# EAGLE design isoSPI UART Test Board rev1 (EAGLE 9.6.2)

## Sheet 1 of 2: PWR, ICs, I/O
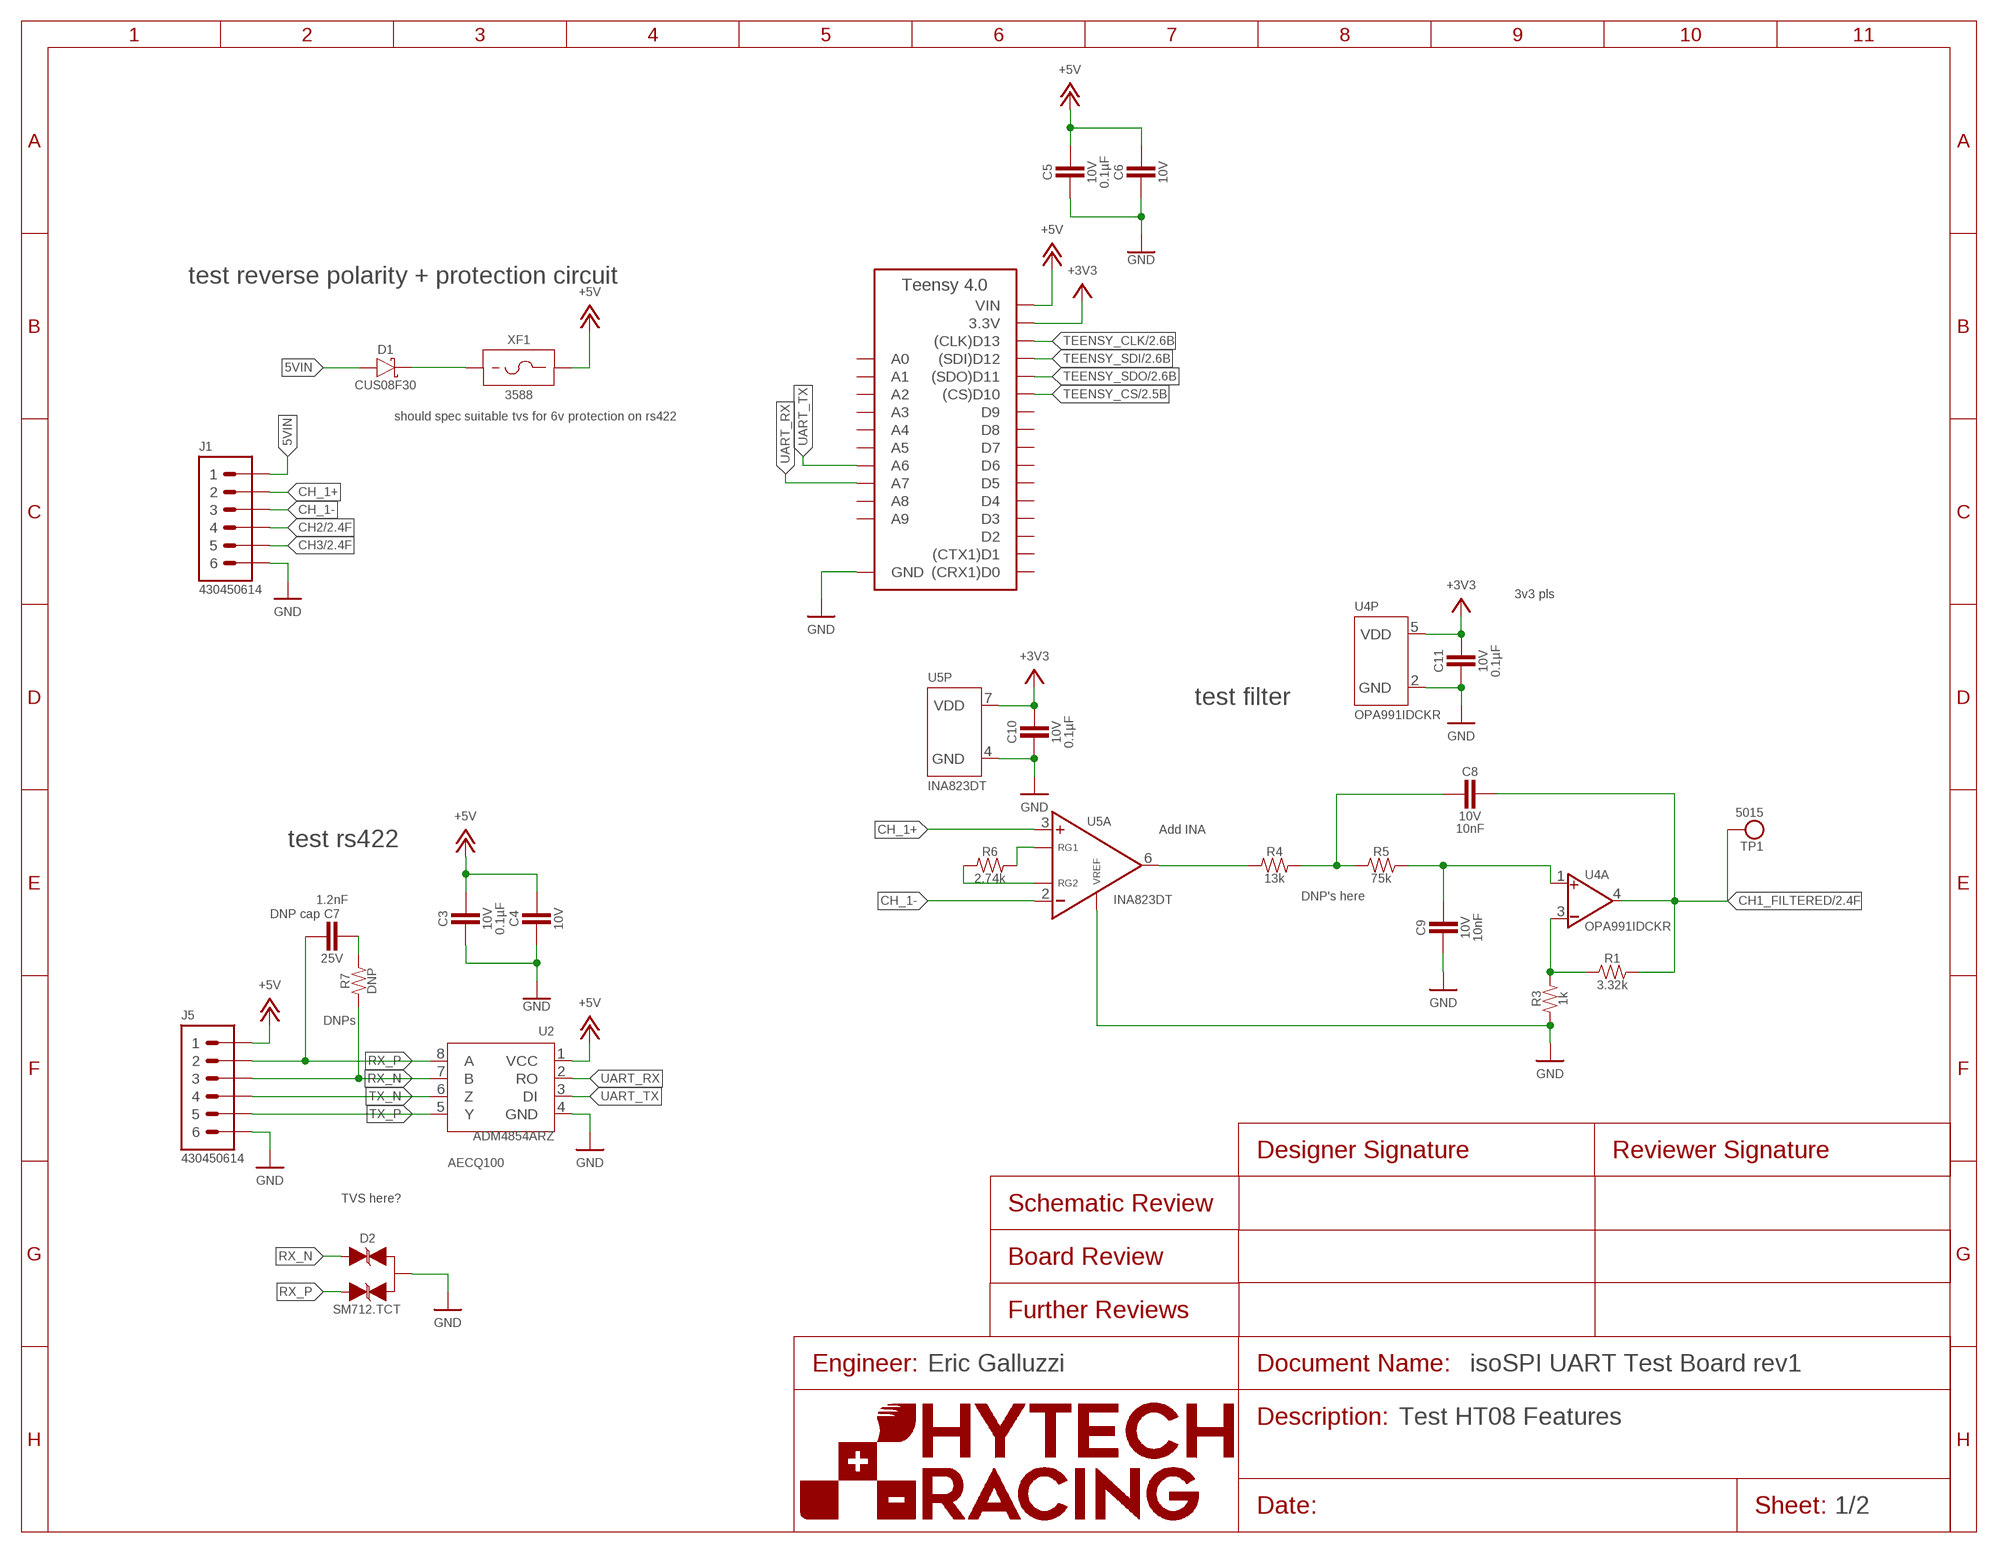
[diagram p0: schematic, sheet 1]
FRAME1 (FRAME): DESCRIPTION_1: Test HT08 Features; ENGINEER: Eric Galluzzi

### Parts
A1  TEENSY_4.0TH  [TEENSY_SHORT]
C3  CAPACITOR_0603_10V_0.1UF  [0603-CAP]
C4  CAPACITOR_0603_10V_1UF  [0603-CAP]
C5  CAPACITOR_0603_10V_0.1UF  [0603-CAP]
C6  CAPACITOR_0603_10V_1UF  [0603-CAP]
C7  CAPACITOR_0603_25V_1.2NF  [0603-CAP]
C8  CAPACITOR_0603_10V_10NF  [0603-CAP]
C9  CAPACITOR_0603_10V_10NF  [0603-CAP]
C10  CAPACITOR_0603_10V_0.1UF  [0603-CAP]
C11  CAPACITOR_0603_10V_0.1UF  [0603-CAP]
D1  SCHOTTKY_SOD323_30V  [SOD-323]
D2  TVS_BIDIRECTIONAL_DUALRS422  [SOT-23]
J1  CONNECTOR-6_μF_T_V_BLACK  [MOLEX_MICROFIT_PTH_VERTICAL_06_DUAL]
J5  CONNECTOR-6_μF_T_V_BLACK  [MOLEX_MICROFIT_PTH_VERTICAL_06_DUAL]
R1  RESISTOR_0603_3.32K  [0603-RES]
R3  RESISTOR_0603_1K  [0603-RES]
R4  RESISTOR_0603_13K  [0603-RES]
R5  RESISTOR_0603_75K  [0603-RES]
R6  RESISTOR_0603_2.74K  [0603-RES]
R7  RESISTOR_0603_DNP  [0603-RES]
TP1  TEST_POINT  [5015]
U2  ADM4854ARZ  [SOIC-08(NARROW,0.15")]
U4  OPAMP_1_CHANNEL_OPA991  [SC-70-5]
U5  INA823DT  [SOIC-08(NARROW,0.15")]
XF1  FUSE_HOLDER_MINIBLADESMD  [3588]

### Nets
5VIN: D1.A J1.1
+3V3: A1.3.3V C10.1 C11.1 U4.5(P:VDD) U5.7(P:VDD) ; also sheet 2
+5V: A1.VIN C3.1 C4.1 C5.1 C6.1 J5.1 U2.1(VCC) XF1.3 XF1.4
CH1: R4.1 U5.6(A:VOUT)
CH1_FILTERED: C8.1 R1.2 TP1.1 U4.4(A:VOUT) ; also sheet 2
CH2: J1.4 ; also sheet 2
CH3: J1.5 ; also sheet 2
CH_1+: J1.2 U5.3(A:VIN+)
CH_1-: J1.3 U5.2(A:VIN-)
GND: A1.AGND/GND(GND) A1.GND C3.2 C4.2 C5.2 C6.2 C9.2 C10.2 C11.2 D2.3(A) J1.6 J5.6 R3.1 U2.4(GND) U4.2(P:GND) U5.4(P:GND) U5.5(A:VREF) ; also sheet 2
N$2: C7.1 R7.2
N$3: D1.C XF1.1 XF1.2
N$5: R1.1 R3.2 U4.3(A:VIN-)
N$8: R6.2 U5.1(A:RG1)
N$9: R6.1 U5.8(A:RG2)
N$13: C8.2 R4.2 R5.1
N$14: C9.1 R5.2 U4.1(A:VIN+)
RX_N [diff pairs]: D2.1(C1) J5.3 R7.1 U2.7(B)
RX_P [diff pairs]: C7.2 D2.2(C2) J5.2 U2.8(A)
TEENSY_CLK: A1.D13((CLK)D13) ; also sheet 2
TEENSY_CS: A1.D10((CS)D10) ; also sheet 2
TEENSY_SDI: A1.D12((SDI)D12) ; also sheet 2
TEENSY_SDO: A1.D11((SDO)D11) ; also sheet 2
TX_N [diff pairs]: J5.4 U2.6(Z)
TX_P [diff pairs]: J5.5 U2.5(Y)
UART_RX: A1.D21(A7) U2.2(RO)
UART_TX: A1.D20(A6) U2.3(DI)
Unconnected: A1.D0((CRX1)D0) A1.D1((CTX1)D1) A1.D2 A1.D3 A1.D4 A1.D5 A1.D6 A1.D7 A1.D8 A1.D9 A1.D14(A0) A1.D15(A1) A1.D16(A2) A1.D17(A3) A1.D18(A4) A1.D19(A5) A1.D22(A8) A1.D23(A9)

### Notes on the sheet
- test reverse polarity + protection circuit
- should spec suitable tvs for 6v protection on rs422
- 3v3 pls
- test filter
- test rs422 | Add INA
- DNP's here
- DNP cap
- DNPs
- AECQ100
- TVS here?

## Sheet 2 of 2: isoSPI
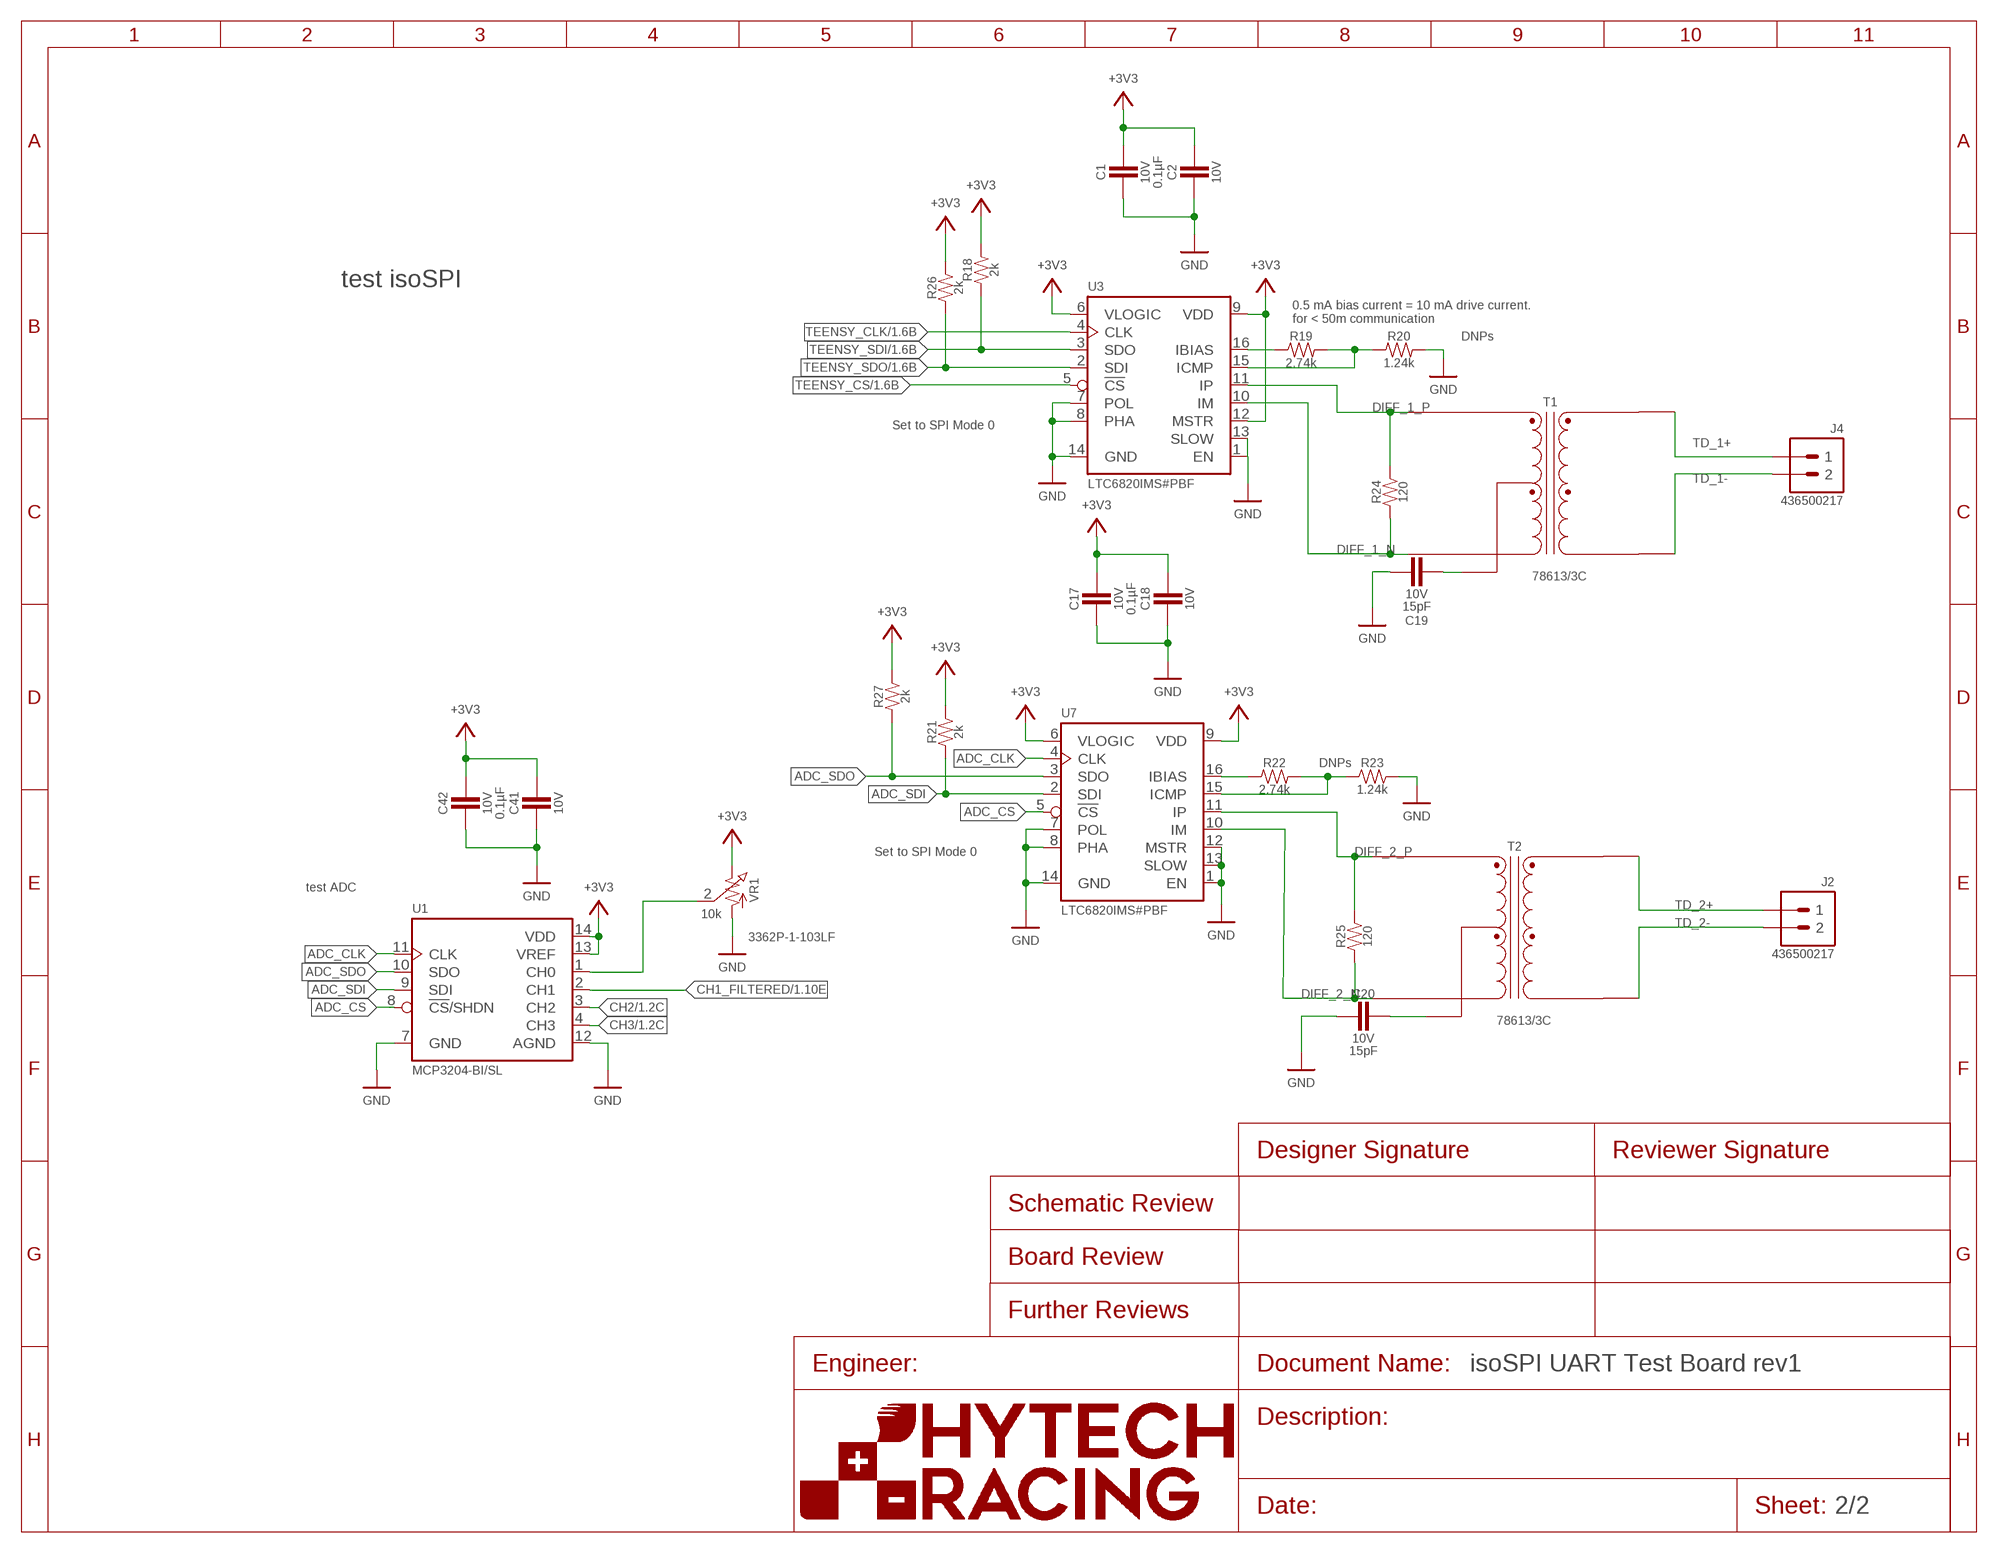
[diagram p1: schematic, sheet 2]

### Parts
C1  CAPACITOR_0603_10V_0.1UF  [0603-CAP]
C2  CAPACITOR_0603_10V_1UF  [0603-CAP]
C17  CAPACITOR_0603_10V_0.1UF  [0603-CAP]
C18  CAPACITOR_0603_10V_1UF  [0603-CAP]
C19  CAPACITOR_0603_10V_15PF  [0603-CAP]
C20  CAPACITOR_0603_10V_15PF  [0603-CAP]
C41  CAPACITOR_0603_10V_1UF  [0603-CAP]
C42  CAPACITOR_0603_10V_0.1UF  [0603-CAP]
J2  CONNECTOR-2_MF_T_V_  [MOLEX_MICROFIT_PTH_VERTICAL_02_SINGLE]
J4  CONNECTOR-2_MF_T_V_  [MOLEX_MICROFIT_PTH_VERTICAL_02_SINGLE]
R18  RESISTOR_0603_2K  [0603-RES]
R19  RESISTOR_0603_2.74K  [0603-RES]
R20  RESISTOR_0603_1.24K  [0603-RES]
R21  RESISTOR_0603_2K  [0603-RES]
R22  RESISTOR_0603_2.74K  [0603-RES]
R23  RESISTOR_0603_1.24K  [0603-RES]
R24  RESISTOR_0603_120  [0603-RES]
R25  RESISTOR_0603_120  [0603-RES]
R26  RESISTOR_0603_2K  [0603-RES]
R27  RESISTOR_0603_2K  [0603-RES]
T1  78613/3C  [78613/3C]
T2  78613/3C  [78613/3C]
U1  MCP3204  [SOIC-14]
U3  LTC6820  [MSOP-16]
U7  LTC6820  [MSOP-16]
VR1  RESISTOR_TRIMPOT_10K_3362P  [3362P]

### Nets
+3V3: C1.1 C2.1 C17.1 C18.1 C41.1 C42.1 R18.2 R21.2 R26.2 R27.2 U1.13(VREF) U1.14(VDD) U3.6(VLOGIC) U3.9(VDD) U3.12(MSTR) U7.6(VLOGIC) U7.9(VDD) VR1.3 ; also sheet 1
ADC_CLK: U1.11(CLK) U7.4(CLK)
ADC_CS: U1.8(!CS!/SHDN) U7.5(!CS)
ADC_SDI: R21.1 U1.9(SDI) U7.2(SDI)
ADC_SDO: R27.1 U1.10(SDO) U7.3(SDO)
CH1_FILTERED: U1.2(CH1) ; also sheet 1
CH2: U1.3(CH2) ; also sheet 1
CH3: U1.4(CH3) ; also sheet 1
DIFF_1_N [diff pairs]: R24.1 T1.3(PRI_2) U3.10(IM)
DIFF_1_P [diff pairs]: R24.2 T1.1(PRI_1) U3.11(IP)
DIFF_2_N [diff pairs]: R25.1 T2.3(PRI_2) U7.10(IM)
DIFF_2_P [diff pairs]: R25.2 T2.1(PRI_1) U7.11(IP)
GND: C1.2 C2.2 C17.2 C18.2 C19.2 C20.2 C41.2 C42.2 R20.2 R23.2 U1.7(GND) U1.12(AGND) U3.1(EN) U3.7(POL) U3.8(PHA) U3.13(SLOW) U3.14(GND) U7.1(EN) U7.7(POL) U7.8(PHA) U7.12(MSTR) U7.13(SLOW) U7.14(GND) VR1.1 ; also sheet 1
N$1: U1.1(CH0) VR1.2
N$4: R19.1 U3.16(IBIAS)
N$6: R19.2 R20.1 U3.15(ICMP)
N$16: R22.1 U7.16(IBIAS)
N$17: R22.2 R23.1 U7.15(ICMP)
N$18: C19.1 T1.2(PRI_CENTER_TAP)
N$19: C20.1 T2.2(PRI_CENTER_TAP)
TD_1+: J4.1 T1.6(SEC_2)
TD_1-: J4.2 T1.4(SEC_1)
TD_2+: J2.1 T2.6(SEC_2)
TD_2-: J2.2 T2.4(SEC_1)
TEENSY_CLK: U3.4(CLK) ; also sheet 1
TEENSY_CS: U3.5(!CS) ; also sheet 1
TEENSY_SDI: R18.1 U3.3(SDO) ; also sheet 1
TEENSY_SDO: R26.1 U3.2(SDI) ; also sheet 1

### Notes on the sheet
- test isoSPI
- 0.5 mA bias current = 10 mA drive current.
  for < 50m communication
- DNPs
- Set to SPI Mode 0
- DNPs
- Set to SPI Mode 0
- test ADC

## Library data of the parts
A1 = HyTechDevices:TEENSY_4.0: Teensy 4.0 Datasheet Requires ordering of: 2: 14 pin, 0.1" pitch female headers. Recommend Samtec SSM-114-L-SV for surface mount variant.; TEENSY: 4.0
C1 C3 C5 C10 C11 C17 C42 = HyTechDevices:CAPACITOR_?_*: Capacitor, Non-Polarized VJ...1BC Series Datasheet Samsung Datasheet Walsin Datasheet GRM188R61A226ME15D GRM188R61E106MA73D 885012006013 2220Y6300105KXTWS2 Yageo Class 2, X5R TDK C Series AVX Automotive MLCC KEMET X7R Series Kyocera AVX GRM21BR61H C1812W104KDRACTU; CAPACITANCE: 0.1µF; DKPN: 720-1688-1-ND; MANUFACTURER: Vishay Vitramon; MOPN: 77-VJ0603Y104JXQPBC; MPN: VJ0603Y104JXQPW1BC; TOLERANCE: 5%; VOLTAGE: 10V
C2 C4 C6 C18 C41 = HyTechDevices:CAPACITOR_?_*: Capacitor, Non-Polarized VJ...1BC Series Datasheet Samsung Datasheet Walsin Datasheet GRM188R61A226ME15D GRM188R61E106MA73D 885012006013 2220Y6300105KXTWS2 Yageo Class 2, X5R TDK C Series AVX Automotive MLCC KEMET X7R Series Kyocera AVX GRM21BR61H C1812W104KDRACTU; CAPACITANCE: 1µF; DKPN: 311-1796-1-ND; MANUFACTURER: Yageo; MOPN: 603-CC603KRX7R6BB105; MPN: CC0603KRX7R6BB105; TOLERANCE: 10%; VOLTAGE: 10V
C7 = HyTechDevices:CAPACITOR_?_*: Capacitor, Non-Polarized VJ...1BC Series Datasheet Samsung Datasheet Walsin Datasheet GRM188R61A226ME15D GRM188R61E106MA73D 885012006013 2220Y6300105KXTWS2 Yageo Class 2, X5R TDK C Series AVX Automotive MLCC KEMET X7R Series Kyocera AVX GRM21BR61H C1812W104KDRACTU; CAPACITANCE: 1.2nF; DKPN: 311-4079-2-ND; MANUFACTURER: YAGEO; MOPN: 603-CC603KRX7R8BB122; MPN: CC0603KRX7R8BB122; TOLERANCE: 10%; VOLTAGE: 25V
C8 C9 = HyTechDevices:CAPACITOR_?_*: Capacitor, Non-Polarized VJ...1BC Series Datasheet Samsung Datasheet Walsin Datasheet GRM188R61A226ME15D GRM188R61E106MA73D 885012006013 2220Y6300105KXTWS2 Yageo Class 2, X5R TDK C Series AVX Automotive MLCC KEMET X7R Series Kyocera AVX GRM21BR61H C1812W104KDRACTU; CAPACITANCE: 10nF; DKPN: 311-4054-1-ND; MANUFACTURER: Yageo; MOPN: 603-CC603KRX7R6BB103; MPN: CC0603KRX7R6BB103; TOLERANCE: 10%; VOLTAGE: 10V
C19 C20 = HyTechDevices:CAPACITOR_?_*: Capacitor, Non-Polarized VJ...1BC Series Datasheet Samsung Datasheet Walsin Datasheet GRM188R61A226ME15D GRM188R61E106MA73D 885012006013 2220Y6300105KXTWS2 Yageo Class 2, X5R TDK C Series AVX Automotive MLCC KEMET X7R Series Kyocera AVX GRM21BR61H C1812W104KDRACTU; CAPACITANCE: 15pF; DKPN: 720-VJ0603A150FXQPW1BCCT-ND; MANUFACTURER: Vishay Vitramon; MOPN: 77-VJ0603A150FXQPBC; MPN: VJ0603A150FXQPW1BC; TOLERANCE: 1%; VOLTAGE: 10V
D1 = HyTechDevices:SCHOTTKY_?_*: CUS08F30 Shottky Diode Datasheet; CURRENT: 0.8A; DKPN: CUS08F30H3FTR-ND; MANUFACTURER: Toshiba Semiconductor and Storage; MOPN: 757-CUS08F30H3F; MPN: CUS08F30; VOLTAGE: 30V
D2 = HyTechDevices:TVS_BIDIRECTIONAL_DUAL: Bdirectional TVS for CAN ESD Datasheet <https://www.ti.com/lit/ds/symlink/tpd2e007.pdf?HQS=dis-mous-null-mousermode-dsf-pf-null-wwe&ts=1615155679700&ref_url=https%253A%252F%252Fwww.mouser.com%252F> SM712 Bidirectional TVS Diode -7V to 12V RSV Used for RS485 transreceiver chips (Works for RS422 since ADM4854ARZ runs both) Datasheet <https://semtech.my.salesforce.com/sfc/p/#E0000000JelG/a/440000001MKW/f6pBKheIN2CeR0DxWdS3THuJ7nh4aKYltSzghsLP5iw>; DKPN: SM712CT-ND; MANUFACTURER: Semtech Corporation; MOPN: 947-SM712.TCT; MPN: SM712.TCT
J1 J5 = HyTechDevices:CONNECTOR-6_?_*: 6 Pin Connector; DKPN: WM1797-ND; MANUFACTURER: Molex; MOPN: 538-43045-0614; MPN: 430450614
J2 J4 = HyTechDevices - Copy:CONNECTOR-2_?_*: 2 Pin Connector; MANUFACTURER: MOLEX; MPN: 436500217
R1 = HyTechDevices:RESISTOR_?_*: Resistor PWR163 Series <https://www.mouser.com/datasheet/2/54/pwr163-777985.pdf> AC Series <https://www.mouser.com/datasheet/2/447/Yageo_PYu_AC_51_RoHS_L_7_1714230-1874691.pdf> PU Series <https://www.mouser.com/datasheet/2/447/PYu-PU_51_RoHS_L_6-1504619.pdf> ERA Series <https://www.mouser.com/datasheet/2/315/AOA0000C307-1149632.pdf> PWR263 Series <https://www.mouser.com/datasheet/2/54/pwr263s_35-778069.pdf> KTR Series <https://www.mouser.com/datasheet/2/348/ROHM_S_A0011075115_1-2563276.pdf> RC Series <https://www.mouser.com/datasheet/2/447/Yageo_03_18_2021_PYu_RC_Group_51_RoHS_L_11-2199992.pdf> ERJ PB3, PB6 Series <https://www.mouser.com/datasheet/2/315/AOA0000C328-1530132.pdf> ERJ PA2, P03, PA3, P06, P08, P14 Series <https://www.mouser.com/datasheet/2/315/AOA0000C331-1141874.pdf> B20 Series <https://www.ohmite.com/assets/docs/res_200.pdf?r=false> TE Connectivity/Holsworthy RN73 Series <https://www.mouser.com/datasheet/2/418/4/NG_DS_1773270_M-604713.pdf> Vishay Dale D/CRCW e3 <https://www.mouser.com/datasheet/2/427/dcrcwe3-1762152.pdf> Ohmite B20 <https://www.ohmite.com/assets/docs/res_200.pdf?r=false>; DKPN: YAG1651TR-ND; MANUFACTURER: Yageo; MOPN: 603-RT0603BRD073K32L; MPN: RT0603BRD073K32L; POWER: 0.1W; RESISTANCE: 3.32k; TOLERANCE: 0.1%; VOLTAGE_CONTINUOUS: 18.22V; VOLTAGE_MAX: 75V
R3 = HyTechDevices:RESISTOR_?_*: Resistor PWR163 Series <https://www.mouser.com/datasheet/2/54/pwr163-777985.pdf> AC Series <https://www.mouser.com/datasheet/2/447/Yageo_PYu_AC_51_RoHS_L_7_1714230-1874691.pdf> PU Series <https://www.mouser.com/datasheet/2/447/PYu-PU_51_RoHS_L_6-1504619.pdf> ERA Series <https://www.mouser.com/datasheet/2/315/AOA0000C307-1149632.pdf> PWR263 Series <https://www.mouser.com/datasheet/2/54/pwr263s_35-778069.pdf> KTR Series <https://www.mouser.com/datasheet/2/348/ROHM_S_A0011075115_1-2563276.pdf> RC Series <https://www.mouser.com/datasheet/2/447/Yageo_03_18_2021_PYu_RC_Group_51_RoHS_L_11-2199992.pdf> ERJ PB3, PB6 Series <https://www.mouser.com/datasheet/2/315/AOA0000C328-1530132.pdf> ERJ PA2, P03, PA3, P06, P08, P14 Series <https://www.mouser.com/datasheet/2/315/AOA0000C331-1141874.pdf> B20 Series <https://www.ohmite.com/assets/docs/res_200.pdf?r=false> TE Connectivity/Holsworthy RN73 Series <https://www.mouser.com/datasheet/2/418/4/NG_DS_1773270_M-604713.pdf> Vishay Dale D/CRCW e3 <https://www.mouser.com/datasheet/2/427/dcrcwe3-1762152.pdf> Ohmite B20 <https://www.ohmite.com/assets/docs/res_200.pdf?r=false>; DKPN: 1712-CPF-A-0603B1K0ETR-ND; MANUFACTURER: TE Connectivity Passive Product; MOPN: 279-CPF-A-0603B1K0E; MPN: CPF-A-0603B1K0E; POWER: 0.0625W; RESISTANCE: 1k; TOLERANCE: 0.1%; VOLTAGE_CONTINUOUS: 7.9V; VOLTAGE_MAX: 50V
R4 = HyTechDevices:RESISTOR_?_*: Resistor PWR163 Series <https://www.mouser.com/datasheet/2/54/pwr163-777985.pdf> AC Series <https://www.mouser.com/datasheet/2/447/Yageo_PYu_AC_51_RoHS_L_7_1714230-1874691.pdf> PU Series <https://www.mouser.com/datasheet/2/447/PYu-PU_51_RoHS_L_6-1504619.pdf> ERA Series <https://www.mouser.com/datasheet/2/315/AOA0000C307-1149632.pdf> PWR263 Series <https://www.mouser.com/datasheet/2/54/pwr263s_35-778069.pdf> KTR Series <https://www.mouser.com/datasheet/2/348/ROHM_S_A0011075115_1-2563276.pdf> RC Series <https://www.mouser.com/datasheet/2/447/Yageo_03_18_2021_PYu_RC_Group_51_RoHS_L_11-2199992.pdf> ERJ PB3, PB6 Series <https://www.mouser.com/datasheet/2/315/AOA0000C328-1530132.pdf> ERJ PA2, P03, PA3, P06, P08, P14 Series <https://www.mouser.com/datasheet/2/315/AOA0000C331-1141874.pdf> B20 Series <https://www.ohmite.com/assets/docs/res_200.pdf?r=false> TE Connectivity/Holsworthy RN73 Series <https://www.mouser.com/datasheet/2/418/4/NG_DS_1773270_M-604713.pdf> Vishay Dale D/CRCW e3 <https://www.mouser.com/datasheet/2/427/dcrcwe3-1762152.pdf> Ohmite B20 <https://www.ohmite.com/assets/docs/res_200.pdf?r=false>; DKPN: P13KBECT-ND; MANUFACTURER: Panasonic Electronic Components; MOPN: 667-ERA-3ARW133V; MPN: ERA-3ARW133V; POWER: 0.1W; RESISTANCE: 13k; TOLERANCE: 0.05%; VOLTAGE_CONTINUOUS: 75V; VOLTAGE_MAX: 150V
R5 = HyTechDevices:RESISTOR_?_*: Resistor PWR163 Series <https://www.mouser.com/datasheet/2/54/pwr163-777985.pdf> AC Series <https://www.mouser.com/datasheet/2/447/Yageo_PYu_AC_51_RoHS_L_7_1714230-1874691.pdf> PU Series <https://www.mouser.com/datasheet/2/447/PYu-PU_51_RoHS_L_6-1504619.pdf> ERA Series <https://www.mouser.com/datasheet/2/315/AOA0000C307-1149632.pdf> PWR263 Series <https://www.mouser.com/datasheet/2/54/pwr263s_35-778069.pdf> KTR Series <https://www.mouser.com/datasheet/2/348/ROHM_S_A0011075115_1-2563276.pdf> RC Series <https://www.mouser.com/datasheet/2/447/Yageo_03_18_2021_PYu_RC_Group_51_RoHS_L_11-2199992.pdf> ERJ PB3, PB6 Series <https://www.mouser.com/datasheet/2/315/AOA0000C328-1530132.pdf> ERJ PA2, P03, PA3, P06, P08, P14 Series <https://www.mouser.com/datasheet/2/315/AOA0000C331-1141874.pdf> B20 Series <https://www.ohmite.com/assets/docs/res_200.pdf?r=false> TE Connectivity/Holsworthy RN73 Series <https://www.mouser.com/datasheet/2/418/4/NG_DS_1773270_M-604713.pdf> Vishay Dale D/CRCW e3 <https://www.mouser.com/datasheet/2/427/dcrcwe3-1762152.pdf> Ohmite B20 <https://www.ohmite.com/assets/docs/res_200.pdf?r=false>; DKPN: RT0603BRE0775KL-ND; MANUFACTURER: Yageo; MOPN: 603-RT0603BRE0775KL; MPN: RT0603BRE0775KL; POWER: 0.1W; RESISTANCE: 75k; TOLERANCE: 0.1%; VOLTAGE_CONTINUOUS: 75V; VOLTAGE_MAX: 75V
R6 R19 R22 = HyTechDevices:RESISTOR_?_*: Resistor PWR163 Series <https://www.mouser.com/datasheet/2/54/pwr163-777985.pdf> AC Series <https://www.mouser.com/datasheet/2/447/Yageo_PYu_AC_51_RoHS_L_7_1714230-1874691.pdf> PU Series <https://www.mouser.com/datasheet/2/447/PYu-PU_51_RoHS_L_6-1504619.pdf> ERA Series <https://www.mouser.com/datasheet/2/315/AOA0000C307-1149632.pdf> PWR263 Series <https://www.mouser.com/datasheet/2/54/pwr263s_35-778069.pdf> KTR Series <https://www.mouser.com/datasheet/2/348/ROHM_S_A0011075115_1-2563276.pdf> RC Series <https://www.mouser.com/datasheet/2/447/Yageo_03_18_2021_PYu_RC_Group_51_RoHS_L_11-2199992.pdf> ERJ PB3, PB6 Series <https://www.mouser.com/datasheet/2/315/AOA0000C328-1530132.pdf> ERJ PA2, P03, PA3, P06, P08, P14 Series <https://www.mouser.com/datasheet/2/315/AOA0000C331-1141874.pdf> B20 Series <https://www.ohmite.com/assets/docs/res_200.pdf?r=false> TE Connectivity/Holsworthy RN73 Series <https://www.mouser.com/datasheet/2/418/4/NG_DS_1773270_M-604713.pdf> Vishay Dale D/CRCW e3 <https://www.mouser.com/datasheet/2/427/dcrcwe3-1762152.pdf> Ohmite B20 <https://www.ohmite.com/assets/docs/res_200.pdf?r=false>; DKPN: P20020CT-ND; MANUFACTURER: Panasonic Electronic Components; MOPN: 667-ERJ-PB3B2741V; MPN: ERJ-PB3B2741V; POWER: 0.2W; RESISTANCE: 2.74k; TOLERANCE: 0.1%; VOLTAGE_CONTINUOUS: 23.41V; VOLTAGE_MAX: 150V
R7 = HyTechDevices:RESISTOR_?_*: Resistor PWR163 Series <https://www.mouser.com/datasheet/2/54/pwr163-777985.pdf> AC Series <https://www.mouser.com/datasheet/2/447/Yageo_PYu_AC_51_RoHS_L_7_1714230-1874691.pdf> PU Series <https://www.mouser.com/datasheet/2/447/PYu-PU_51_RoHS_L_6-1504619.pdf> ERA Series <https://www.mouser.com/datasheet/2/315/AOA0000C307-1149632.pdf> PWR263 Series <https://www.mouser.com/datasheet/2/54/pwr263s_35-778069.pdf> KTR Series <https://www.mouser.com/datasheet/2/348/ROHM_S_A0011075115_1-2563276.pdf> RC Series <https://www.mouser.com/datasheet/2/447/Yageo_03_18_2021_PYu_RC_Group_51_RoHS_L_11-2199992.pdf> ERJ PB3, PB6 Series <https://www.mouser.com/datasheet/2/315/AOA0000C328-1530132.pdf> ERJ PA2, P03, PA3, P06, P08, P14 Series <https://www.mouser.com/datasheet/2/315/AOA0000C331-1141874.pdf> B20 Series <https://www.ohmite.com/assets/docs/res_200.pdf?r=false> TE Connectivity/Holsworthy RN73 Series <https://www.mouser.com/datasheet/2/418/4/NG_DS_1773270_M-604713.pdf> Vishay Dale D/CRCW e3 <https://www.mouser.com/datasheet/2/427/dcrcwe3-1762152.pdf> Ohmite B20 <https://www.ohmite.com/assets/docs/res_200.pdf?r=false>; RESISTANCE: DNP
R18 R21 R26 R27 = HyTechDevices:RESISTOR_?_*: Resistor PWR163 Series <https://www.mouser.com/datasheet/2/54/pwr163-777985.pdf> AC Series <https://www.mouser.com/datasheet/2/447/Yageo_PYu_AC_51_RoHS_L_7_1714230-1874691.pdf> PU Series <https://www.mouser.com/datasheet/2/447/PYu-PU_51_RoHS_L_6-1504619.pdf> ERA Series <https://www.mouser.com/datasheet/2/315/AOA0000C307-1149632.pdf> PWR263 Series <https://www.mouser.com/datasheet/2/54/pwr263s_35-778069.pdf> KTR Series <https://www.mouser.com/datasheet/2/348/ROHM_S_A0011075115_1-2563276.pdf> RC Series <https://www.mouser.com/datasheet/2/447/Yageo_03_18_2021_PYu_RC_Group_51_RoHS_L_11-2199992.pdf> ERJ PB3, PB6 Series <https://www.mouser.com/datasheet/2/315/AOA0000C328-1530132.pdf> ERJ PA2, P03, PA3, P06, P08, P14 Series <https://www.mouser.com/datasheet/2/315/AOA0000C331-1141874.pdf> B20 Series <https://www.ohmite.com/assets/docs/res_200.pdf?r=false> TE Connectivity/Holsworthy RN73 Series <https://www.mouser.com/datasheet/2/418/4/NG_DS_1773270_M-604713.pdf> Vishay Dale D/CRCW e3 <https://www.mouser.com/datasheet/2/427/dcrcwe3-1762152.pdf> Ohmite B20 <https://www.ohmite.com/assets/docs/res_200.pdf?r=false>; DKPN: 10-ERJ-UP3F2001VTR-ND; MANUFACTURER: Panasonic Electronic Components; MOPN: 667-ERJ-UP3F2001V; MPN: ERJ-UP3F2001V; POWER: 0.25W; RESISTANCE: 2k; TOLERANCE: 1%; VOLTAGE_CONTINUOUS: 22.36V; VOLTAGE_MAX: 150V
R20 R23 = HyTechDevices:RESISTOR_?_*: Resistor PWR163 Series <https://www.mouser.com/datasheet/2/54/pwr163-777985.pdf> AC Series <https://www.mouser.com/datasheet/2/447/Yageo_PYu_AC_51_RoHS_L_7_1714230-1874691.pdf> PU Series <https://www.mouser.com/datasheet/2/447/PYu-PU_51_RoHS_L_6-1504619.pdf> ERA Series <https://www.mouser.com/datasheet/2/315/AOA0000C307-1149632.pdf> PWR263 Series <https://www.mouser.com/datasheet/2/54/pwr263s_35-778069.pdf> KTR Series <https://www.mouser.com/datasheet/2/348/ROHM_S_A0011075115_1-2563276.pdf> RC Series <https://www.mouser.com/datasheet/2/447/Yageo_03_18_2021_PYu_RC_Group_51_RoHS_L_11-2199992.pdf> ERJ PB3, PB6 Series <https://www.mouser.com/datasheet/2/315/AOA0000C328-1530132.pdf> ERJ PA2, P03, PA3, P06, P08, P14 Series <https://www.mouser.com/datasheet/2/315/AOA0000C331-1141874.pdf> B20 Series <https://www.ohmite.com/assets/docs/res_200.pdf?r=false> TE Connectivity/Holsworthy RN73 Series <https://www.mouser.com/datasheet/2/418/4/NG_DS_1773270_M-604713.pdf> Vishay Dale D/CRCW e3 <https://www.mouser.com/datasheet/2/427/dcrcwe3-1762152.pdf> Ohmite B20 <https://www.ohmite.com/assets/docs/res_200.pdf?r=false>; DKPN: 311-1.24KHRCT-ND; MANUFACTURER: Yageo; MOPN: 603-RC0603FR-071K24L; MPN: RC0603FR-071K24L; POWER: 0.1W; RESISTANCE: 1.24k; TOLERANCE: 1%; VOLTAGE_CONTINUOUS: 11.14V; VOLTAGE_MAX: 75V
R24 R25 = HyTechDevices:RESISTOR_?_*: Resistor PWR163 Series <https://www.mouser.com/datasheet/2/54/pwr163-777985.pdf> AC Series <https://www.mouser.com/datasheet/2/447/Yageo_PYu_AC_51_RoHS_L_7_1714230-1874691.pdf> PU Series <https://www.mouser.com/datasheet/2/447/PYu-PU_51_RoHS_L_6-1504619.pdf> ERA Series <https://www.mouser.com/datasheet/2/315/AOA0000C307-1149632.pdf> PWR263 Series <https://www.mouser.com/datasheet/2/54/pwr263s_35-778069.pdf> KTR Series <https://www.mouser.com/datasheet/2/348/ROHM_S_A0011075115_1-2563276.pdf> RC Series <https://www.mouser.com/datasheet/2/447/Yageo_03_18_2021_PYu_RC_Group_51_RoHS_L_11-2199992.pdf> ERJ PB3, PB6 Series <https://www.mouser.com/datasheet/2/315/AOA0000C328-1530132.pdf> ERJ PA2, P03, PA3, P06, P08, P14 Series <https://www.mouser.com/datasheet/2/315/AOA0000C331-1141874.pdf> B20 Series <https://www.ohmite.com/assets/docs/res_200.pdf?r=false> TE Connectivity/Holsworthy RN73 Series <https://www.mouser.com/datasheet/2/418/4/NG_DS_1773270_M-604713.pdf> Vishay Dale D/CRCW e3 <https://www.mouser.com/datasheet/2/427/dcrcwe3-1762152.pdf> Ohmite B20 <https://www.ohmite.com/assets/docs/res_200.pdf?r=false>; DKPN: P120DBCT-ND; MANUFACTURER: Panasonic Electronic Components; MOPN: 667-ERA-3AEB121V; MPN: ERA-3AEB121V; POWER: 0.1W; RESISTANCE: 120; TOLERANCE: 0.1%; VOLTAGE_CONTINUOUS: 3.46V; VOLTAGE_MAX: 75V
T1 T2 = HyTechDevices:78613/3C: Murata 78613/3C Pulse Transformers 1CT:1 200 UH Datasheet <https://www.murata.com/products/productdata/8816046047262/kmp-786.pdf>; DKPN: 811-3726-ND; MANUFACTURER: Murata Power Solutions; MOPN: 580-786133C; MPN: 78613/3C
TP1 = HyTechDevices:TEST_POINT: Test Point for Probing; DKPN: 36-5015CT-ND; MANUFACTURER: Keystone Electronics; MOPN: 534-5015; MPN: 5015
U1 = HyTechDevices:MCP3204: MCP3204 4-Channel ADC Datasheet; DKPN: MCP3204-BI/SL-ND; MANUFACTURER: Microchip Technology; MOPN: 579-MCP3204-BI/SL; MPN: MCP3204-BI/SL
U2 = HyTechDevices:ADM4854ARZ: ADM4854ARZ RS422 Transreceiver Datasheet; DKPN: 505-ADM4854ARZ-ND; MANUFACTURER: Analog Devices Inc.; MOPN: 584-ADM4854ARZ; MPN: ADM4854ARZ
U3 U7 = HyTechDevices:LTC6820: LTC6820 isoSPI Isolated Communications Interface Datasheet; MANUFACTURER: Analog Devices; MPN: LTC6820IMS#PBF
U4 = HyTechDevices:OPAMP_1_CHANNEL_*: Op-Amp 1 Channel OPA991 Datasheet Note: OPA991 is also a comparator; DKPN: 296-OPA991IDCKRCT-ND; MANUFACTURER: Texas Instruments; MOPN: 595-OPA991IDCKR; MPN: OPA991IDCKR
U5 = HyTechDevices:INA823*: INA823 Precision, Low-Power, Wide-Supply (2.7-V to 36-V) Instrumentation Amplifier Datasheet; DKPN: 296-INA823DTCT-ND; MANUFACTURER: Texas Instruments; MOPN: 595-INA823DT; MPN: INA823DT
VR1 = HyTechDevices:RESISTOR_TRIMPOT_*_?: Variable Resistor Bourns 3362P Datasheet; DKPN: 3362P-103LF-ND; MANUFACTURER: Bourns Inc.; MOPN: 652-3362P-1-103LF; MPN: 3362P-1-103LF; POWER: 0.5W; RESISTANCE: 10k; TOLERANCE: 10%; VOLTAGE: 70.711V
XF1 = HyTechDevices:FUSE_HOLDER_*: Fuse Holder All PNs for the holder; if Miniblade Fuses <https://www.littelfuse.com/media?resourcetype=datasheets&itemid=0f5f58cb-559e-494b-8d53-723f30445ae5&filename=littelfuse-mini-datasheet> needed, order separately. Mini-Blade PTH <https://www.mouser.com/datasheet/2/215/3568-742601.pdf> Mini-Blade SMD <https://www.mouser.com/datasheet/2/215/588-744913.pdf> Littelfuse 122 Fuse Holder and Fuse Fuse <https://www.littelfuse.com/~/media/electronics/datasheets/fuses/littelfuse_fuse_508_datasheet.pdf.pdf> Fuse Holder <https://www.littelfuse.com/~/media/electronics/datasheets/fuse_clips/littelfuse_fuse_clip_102_122_datasheet.pdf.pdf>; DKPN: 36-3588-ND; FUSE_TYPE: MINI 297; MANUFACTURER: Keystone Electronics; MOPN: 534-3588; MPN: 3588

## Net classes
1 diff pairs: width 0.254 mm

## Board
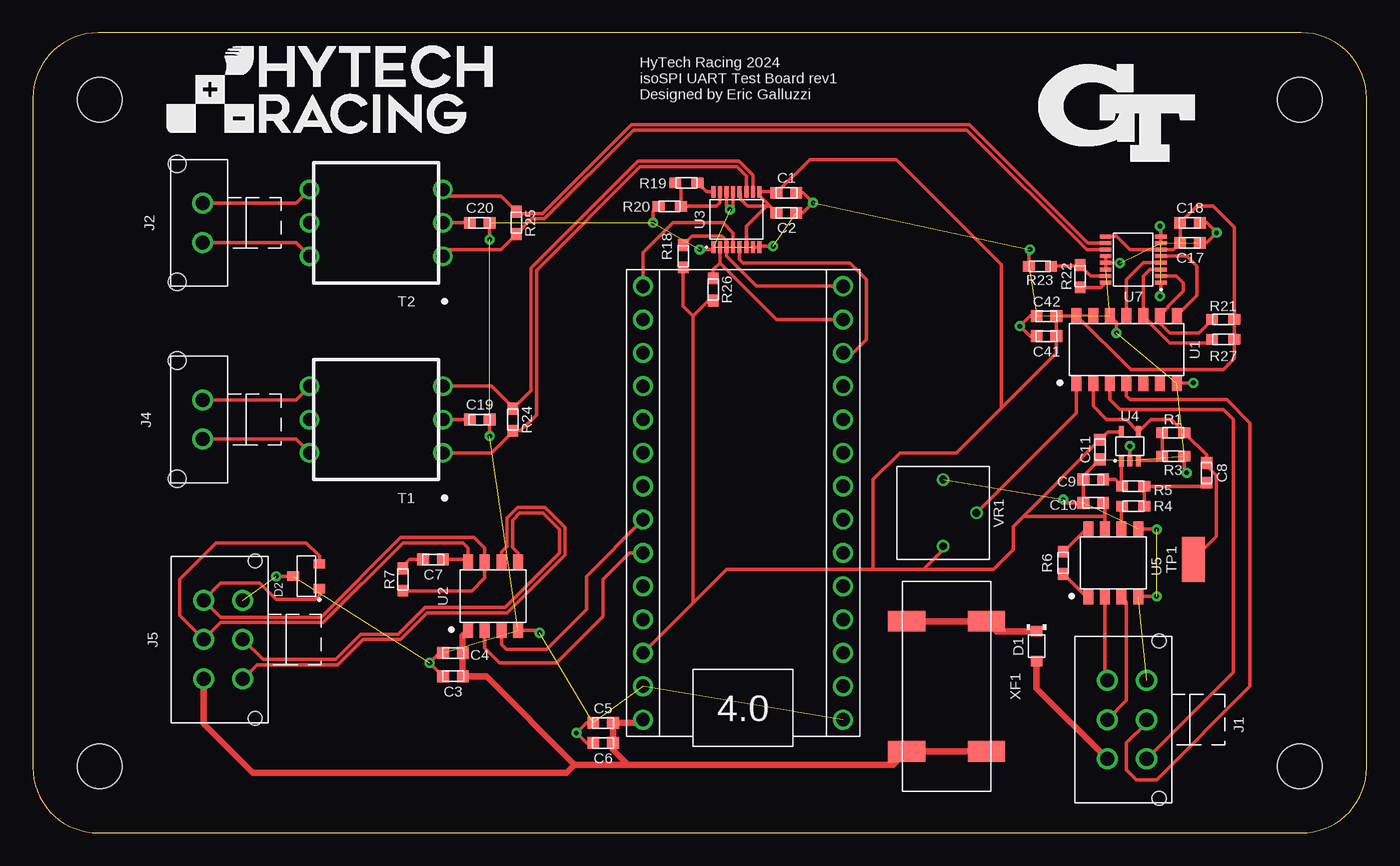
[diagram p2: board, top side]
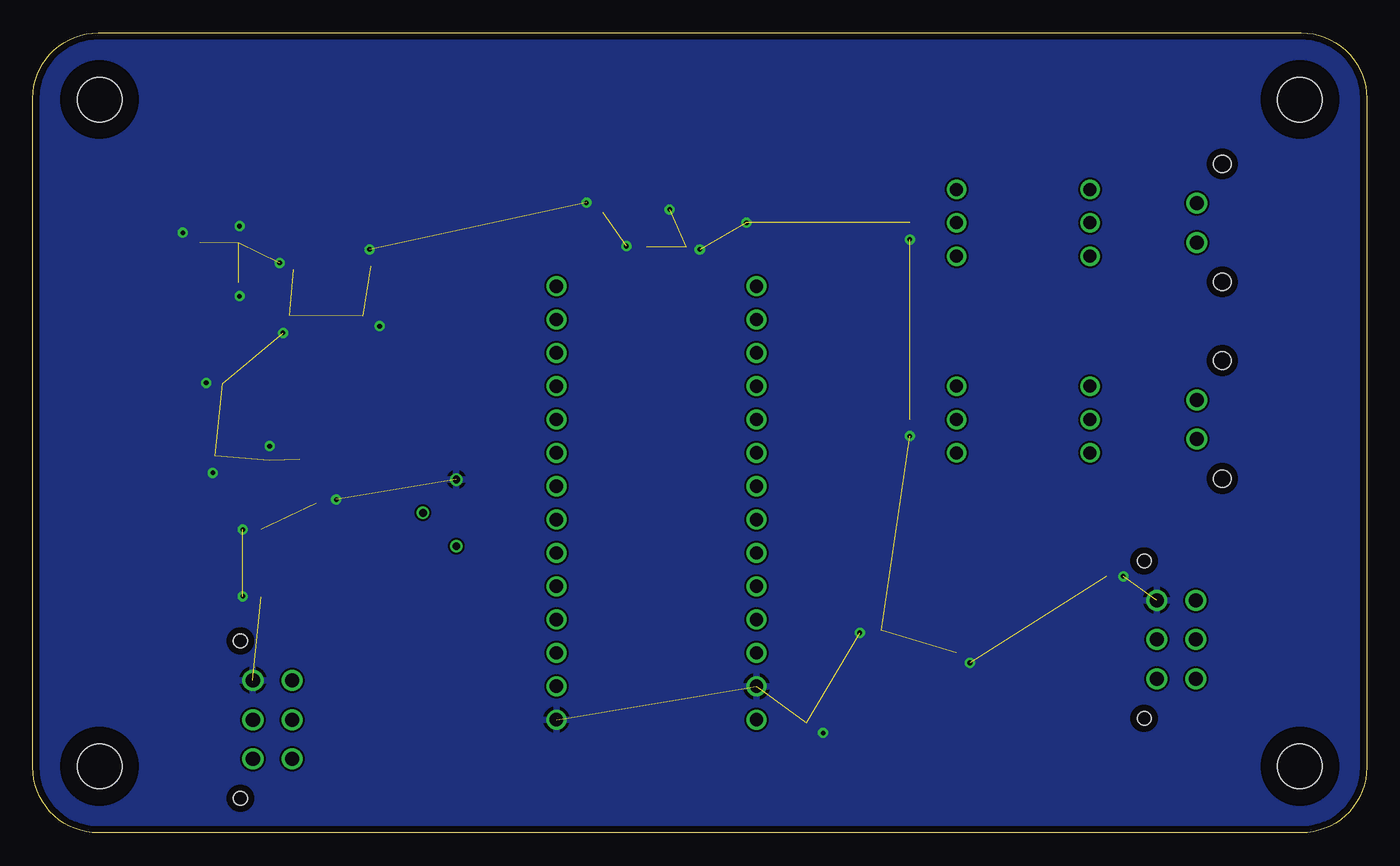
[diagram p3: board, bottom side, seen from below]

Size 101.6 x 60.96 mm. Coordinates in mm from the lower left corner, seen from the top.
Outline: 101.6,5 101.6,55.96 arc90 96.6,60.96 5,60.96 arc90 0,55.96 0,5 arc90 5,0 96.6,0 arc90 101.6,5
Copper layers (1*16): Top 0.035mm / dielectric 1.53mm / Bottom 0.035mm
Design rules "HyTech Default (2 Layer)": minimum track width 6mil, minimum drill 14mil, track to track 6mil, track to pad 6mil, pad to pad 6mil, via to via 20mil, smd to smd 6mil, copper to edge 20mil, drill to drill 21mil, minimum pad ring 7mil, minimum via ring 8mil, stop-mask expansion 6mil, vias tented up to drill 30mil, thermal gap 10mil

### Footprints (pad centres in the part's own frame; a part is rotated, then mirrored left to right if it is on the bottom)
TEENSY_SHORT = drill 1.016: 3.3V 0,5.08; AGND/GND 0,2.54; D0 15.24,2.54; D1 15.24,5.08; D2 15.24,7.62; D3 15.24,10.16; D4 15.24,12.7; D5 15.24,15.24; D6 15.24,17.78; D7 15.24,20.32; D8 15.24,22.86; D9 15.24,25.4; D10 15.24,27.94; D11 15.24,30.48; D12 15.24,33.02; D13 0,33.02; D14 0,30.48; D15 0,27.94; D16 0,25.4; D17 0,22.86; D18 0,20.32; D19 0,17.78; D20 0,15.24; D21 0,12.7; D22 0,10.16; D23 0,7.62; GND 15.24,0; VIN 0,0
0603-CAP = smd 0.9 x 0.9: 1 -0.75,0; 2 0.75,0
SOD-323 = smd 0.8 x 0.9: A -1.15,0; C 1.15,0
SOT-23 = smd 0.711 x 0.889: 1 -0.94,-1.003; 2 0.94,-1.003; 3 0,1.003
MOLEX_MICROFIT_PTH_VERTICAL_06_DUAL = drill 1.067: 1 2.997,-2.997; 2 0,-2.997; 3 -2.997,-2.997; 4 2.997,0; 5 0,0; 6 -2.997,0 | hole 1.067: 5.994,0.94; -5.994,0.94
MOLEX_MICROFIT_PTH_VERTICAL_02_SINGLE = drill 1.067: 1 1.499,0; 2 -1.499,0 | hole 1.321: 4.496,-1.956; -4.496,-1.956
0603-RES = smd 0.9 x 0.8: 1 -0.85,0; 2 0.85,0
78613/3C = drill 0.991 pad 1.2: 1 -5.08,2.54; 2 -5.08,0; 3 -5.08,-2.54; 4 5.08,-2.54; 5 5.08,0; 6 5.08,2.54
5015 = smd 3.429 x 1.778: 1 0,0
SOIC-14 = smd 0.762 x 1.143: 1 -3.81,-2.603; 2 -2.54,-2.603; 3 -1.27,-2.603; 4 0,-2.603; 5 1.27,-2.603; 6 2.54,-2.603; 7 3.81,-2.603; 8 3.81,2.603; 9 2.54,2.603; 10 1.27,2.603; 11 0,2.603; 12 -1.27,2.603; 13 -2.54,2.603; 14 -3.81,2.603
SOIC-08(NARROW,0.15") = smd 0.762 x 1.143: 1 -1.905,-2.603; 2 -0.635,-2.603; 3 0.635,-2.603; 4 1.905,-2.603; 5 1.905,2.603; 6 0.635,2.603; 7 -0.635,2.603; 8 -1.905,2.603
MSOP-16 = smd 0.305 x 0.889: 1 -1.75,-2.106; 2 -1.25,-2.106; 3 -0.75,-2.106; 4 -0.25,-2.106; 5 0.25,-2.106; 6 0.75,-2.106; 7 1.25,-2.106; 8 1.75,-2.106; 9 1.75,2.106; 10 1.25,2.106; 11 0.75,2.106; 12 0.25,2.106; 13 -0.25,2.106; 14 -0.75,2.106; 15 -1.25,2.106; 16 -1.75,2.106
SC-70-5 = smd 0.4 x 0.9: 1 -0.65,-1.1; 2 0,-1.1; 3 0.65,-1.1; 4 0.65,1.1; 5 -0.65,1.1
MOUNTING_M3 = hole 3.4: 0,0
3362P = drill 0.6: 1 -2.54,0; 2 0,2.54; 3 2.54,0
3588 = smd 1.575 x 2.819: 1 -4.953,3.035; 2 -4.953,-3.035; 3 4.953,-3.035; 4 4.953,3.035

### Placement (x,y rotation side)
A1  46.48,8.64 0 top
C1  57.4,48.77 0 top
C2  57.4,47.24 0 top
C3  32,11.94 180 top
C4  32,13.72 180 top
C5  43.43,8.38 180 top
C6  43.43,6.86 180 top
C7  30.48,20.83 0 top
C8  89.41,27.43 270 top
C9  80.77,26.92 180 top
C10  80.77,25.15 180 top
C11  81.28,29.21 270 top
C17  88.14,44.96 0 top
C18  88.14,46.48 0 top
C19  34.04,31.5 0 top
C20  34.04,46.48 0 top
C41  77.22,37.85 180 top
C42  77.22,39.37 180 top
D1  76.45,14.22 90 top
D2  20.83,19.56 90 top
J1  84.84,8.64 270 top
J2  12.95,46.48 270 top
J4  12.95,31.5 270 top
J5  16,14.73 270 top
R1  86.87,30.48 0 top
R3  86.87,28.7 180 top
R4  83.82,24.89 0 top
R5  83.82,26.42 180 top
R6  78.49,20.57 270 top
R7  28.19,19.3 90 top
R18  49.53,43.94 270 top
R19  49.78,49.53 180 top
R20  48.51,47.75 180 top
R21  90.68,39.12 0 top
R22  79.76,42.42 90 top
R23  76.71,43.18 180 top
R24  36.58,31.5 270 top
R25  36.83,46.48 270 top
R26  51.82,41.4 270 top
R27  90.68,37.59 0 top
T1  26.16,31.5 180 top
T2  26.16,46.48 180 top
TP1  88.39,20.83 90 top
U1  83.31,36.83 0 top
U2  35.05,18.03 0 top
U3  53.59,46.74 0 top
U4  83.57,29.46 0 top
U5  82.3,20.57 0 top
U7  83.82,43.69 90 top
U$1  [MOUNTING_M3]  5.08,55.88 0 top
U$2  [MOUNTING_M3]  96.52,55.88 0 top
U$3  [MOUNTING_M3]  96.52,5.08 0 top
U$4  [MOUNTING_M3]  5.08,5.08 0 bottom
U$5  [LOGO_HYTECH_MEDIUM]  10.16,53.34 0 top
U$6  [LOGO_GT_MEDIUM]  82.55,54.86 0 top
VR1  69.34,24.38 270 top
XF1  69.6,11.18 270 top

### Tracks (layer width: path | path; a pad name or v marks a point on that pad's centre or on a via)
5VIN
  Top 0.508: J1.1 76.45,11.02 D1.A
+3V3
  Top 0.152: U1.13 U1.14
  Top 0.254: C10.1 81.66,25.01 81.66,24.13 | 81.66,24.13 U5.7 | U4.5 81.88,30.56 C11.1 75.45,24.13 | 64.01,20.07 67.82,20.07 | 67.82,20.07 69.34,21.59 VR1.3 | 75.45,24.13 74.68,23.36 74.68,21.59 73.15,20.07 67.82,20.07 | 81.66,24.13 75.45,24.13 | U7.9 81.74,45.47 82.55,45.47 83.58,44.44 U7.6 86.87,44.44 C17.1 C18.1 88.66,47.75 89.92,47.75 91.53,46.14 R21.2 R27.2 91.53,36.16 90.68,35.31 83.63,35.31 U1.14 79.44,39.37 C42.1 C41.1 77.97,36.56 73.79,32.38 | C2.1 56.14,47.76 | 56.14,47.76 55.34,48.55 U3.9 56.58,48.84 C1.1 59.19,51.31 65.79,51.31 73.79,43.31 73.79,32.38 | U3.12 53.91,48.77 53.91,48.28 54.44,47.76 55.88,47.76 | 55.88,47.76 56.14,47.76 | U3.6 54.34,46.22 55.88,47.76 | 50.29,39.37 51.47,40.55 R26.2 | 50.29,39.37 49.53,40.13 R18.2 | 50.29,39.37 50.29,17.53 | 64.01,20.07 64.01,26.92 66.04,28.96 70.36,28.96 73.79,32.38 | A1.3.3V 50.29,17.53 | 50.29,17.53 52.83,20.07 64.01,20.07
+5V
  Top 0.508: XF1.4 XF1.3 65.55,5.21 45.33,5.21 | A1.VIN 46.23,8.38 C5.1 C6.1 44.18,6.35 45.33,5.21 | 45.33,5.21 41.27,5.21 | J5.1 13.01,8.33 16.76,4.57 40.64,4.57 41.27,5.21 | 41.27,5.21 34.54,11.94 C3.1 C4.1 32.75,15.04 U2.1
ADC_CLK
  Top 0.254: U1.11 83.31,42.16 84.59,43.44 U7.4
ADC_CS
  Top 0.254: U1.8 88.65,40.96 88.65,43.18 87.89,43.94 U7.5
ADC_SDI
  Top 0.254: U7.2 87.1,42.44 87.63,41.91 87.63,41.29 86.46,40.12 86.46,40.04 U1.9 85.85,38.86 86.61,38.1 88.81,38.1 R21.1
ADC_SDO
  Top 0.254: U7.3 85.1,42.94 84.58,42.42 U1.10 85.19,38.82 85.19,38.75 86.6,37.34 89.57,37.34 R27.1
CH1
  Top 0.254: U5.6 82.93,24.85 R4.1
CH1_FILTERED
  Top 0.254: U1.2 80.77,32.51 81.79,31.5 83.28,31.5 U4.4 85.15,31.5 86.7,31.5 R1.2 89.41,28.79 C8.1 89.41,27.98 90.14,27.25 90.14,22.57 TP1.1
CH2
  Top 0.254: U1.3 82.04,33.02 82.8,32.26 90.68,32.26 91.44,31.5 91.44,12.24 J1.4
CH3
  Top 0.254: U1.4 83.31,33.27 83.57,33.02 90.93,33.02 92.71,31.24 92.71,11.18 85.6,4.06 84.07,4.06 83.31,4.83 83.31,6.86 84.84,8.38 J1.5
CH_1+
  Top 0.254: J1.2 83.31,10.11 83.31,17.59 U5.3
CH_1-
  Top 0.254: J1.3 81.66,11.81 U5.2
DIFF_1_N
  Top 0.254: U3.10 54.84,50.12 53.8,51.17 46.09,51.17 37.95,43.03 37.95,33.72 R24.1 36.58,32.4 34.94,34.04 T1.3
DIFF_1_P
  Top 0.254: U3.11 54.36,48.85 54.36,50.04 53.63,50.77 46.26,50.77 38.35,42.86 38.35,31.85 37.15,30.65 R24.2 36.58,30.6 34.94,28.96 T1.1
DIFF_2_N
  Top 0.254: T2.3 31.75,48.51 35.65,48.51 R25.1 36.83,47.19 38.81,47.19 45.59,53.97 71.32,53.97 80.35,44.94 U7.10
DIFF_2_P
  Top 0.254: U7.11 80.28,44.44 71.15,53.56 45.75,53.56 38.98,46.79 37.98,46.79 R25.2 35.65,44.45 31.75,44.45 T2.1
GND  (via drill 0.36)  (28 unrouted)
  Top 0.254: U5.5 85.53,23.18 v85.6,23.11 | U5.4 84.26,18.03 v85.6,18.03 | C11.2 80.02,27.2 C9.2 C10.2 78.74,25.15 v78.49,25.4 | R3.1 87.72,27.6 v87.88,27.43 | U1.7 87.19,34.29 v88.39,34.29 | U1.12 82.55,38.92 v82.55,38.1 | v38.61,15.24 38.42,15.43 U2.4 | U4.2 v83.57,29.46 | U3.13 53.34,47.76 v53.09,47.5 52.84,47.74 U3.14 | v56.39,44.7 55.42,44.7 U3.8 U3.7 | U3.1 51.66,44.45 v50.8,44.45 | C42.2 75.95,39.37 v75.18,38.61 75.95,37.85 C41.2 | U7.14 U7.13 | U7.12 U7.13 | U7.13 v82.8,43.43 | U7.1 85.92,40.97 v85.85,40.89 | C18.2 89.41,46.48 v90.17,45.72 89.41,44.96 C17.2 | U7.7 U7.8 85.92,46.15 v85.85,46.23 | R23.2 75.86,44.36 v75.95,44.45 | R20.2 47.24,47.33 v47.24,46.48 | C20.2 v34.8,45.21 | C19.2 34.8,31.48 v34.8,30.23 | C1.2 58.67,48.77 v59.44,48.01 58.67,47.24 C2.2 | C6.2 42.16,6.86 v41.4,7.62 42.16,8.38 C5.2 | C4.2 30.99,13.72 v30.23,12.95 C3.2 | D2.3 v18.54,19.56
  pour Bottom: -12.7,71.63 -12.7,-3.56 107.19,-3.56 107.19,71.63
N$1
  Top 0.254: VR1.2 79.5,32 U1.1
N$2
  Top 0.254: C7.1 28.7,20.83 28.19,20.32 R7.2
N$3
  Top 0.508: D1.C 73.39,15.37 XF1.1 XF1.2
N$4
  Top 0.254: U3.16 51.32,48.84 R19.1
N$5
  Top 0.254: U4.3 85.68,28.36 R3.2 R1.1
N$6
  Top 0.254: U3.15 52.34,48.03 52.07,47.75 R20.1 49.36,49.1 R19.2
N$8
  Top 0.254: R6.2 80.24,17.97 U5.1
N$9
  Top 0.254: R6.1 80.24,23.18 U5.8
N$13
  Top 0.254: C8.2 89.14,26.42 R5.1 R4.2
N$14
  Top 0.254: U4.1 82.92,26.47 R5.2 82.46,26.92 C9.1
N$16
  Top 0.254: U7.16 81.34,41.57 R22.1
N$17
  Top 0.254: U7.15 80.59,42.44 R22.2 79.67,43.18 R23.1
N$18
  Top 0.254: T1.2 C19.1
N$19
  Top 0.254: T2.2 C20.1
RX_N
  Top 0.254: R7.1 33.44,18.45 34.42,19.43 U2.7 34.42,21.72 33.63,22.5 28.03,22.5 21.95,16.43 14.3,16.43 J5.3 14.33,19.05 17.27,19.05 18.54,17.78 21.5,17.78 21.83,18.11 D2.1
RX_P
  Top 0.254: C7.2 32.96,20.83 U2.8 33.15,21.72 32.77,22.1 28.19,22.1 22.12,16.03 14.3,16.03 J5.2 11.18,16.56 11.18,19.3 13.97,22.1 20.83,22.1 21.83,21.09 D2.2
TD_1+
  Top 0.254: J4.1 20.04,30 T1.6
TD_1-
  Top 0.254: J4.2 20.04,32.99 T1.4
TD_2+
  Top 0.254: J2.1 20.04,44.98 T2.6
TD_2-
  Top 0.254: J2.2 20.04,47.98 T2.4
TEENSY_CLK
  Top 0.254: A1.D13 46.48,44.2 48.77,46.48 52.58,46.48 53.34,45.72 U3.4
TEENSY_CS
  Top 0.254: U3.5 53.84,43.69 54.1,43.43 62.23,43.43 63.5,42.16 63.5,37.59 62.48,36.58 A1.D10
TEENSY_SDI
  Top 0.254: A1.D12 55.12,41.66 52.84,43.93 U3.3 52.84,45.12 52.5,45.47 50.2,45.47 R18.1
TEENSY_SDO
  Top 0.254: A1.D11 56.64,39.12 52.32,43.43 | 52.32,43.43 52.32,44.61 U3.2 | R26.1 51.82,42.93 52.32,43.43
TX_N
  Top 0.254: J5.4 17.07,12.8 23.22,12.8 25.15,14.73 28.01,14.73 30.04,16.76 36.13,16.76 40.54,21.17 40.54,23.28 39.03,24.79 36.92,24.79 36.12,23.99 36.12,21.84 35.69,21.41 U2.6
TX_P
  Top 0.254: J5.5 17.53,13.21 23.05,13.21 24.98,15.14 27.84,15.14 29.87,17.17 35.97,17.17 40.13,21.34 40.13,23.11 38.86,24.38 37.08,24.38 36.52,23.82 36.52,21.77 36.96,21.34 U2.5
UART_RX
  Top 0.254: U2.2 34.42,14.1 35.56,12.95 39.88,12.95 43.43,16.51 43.43,19.3 45.47,21.34 A1.D21
UART_TX
  Top 0.254: U2.3 35.69,14.35 36.07,13.97 39.12,13.97 42.16,17.02 42.16,19.56 A1.D20

### Text on the board
tNames: HyTech Racing 2024 / isoSPI UART Test Board rev1 / Designed by Eric Galluzzi